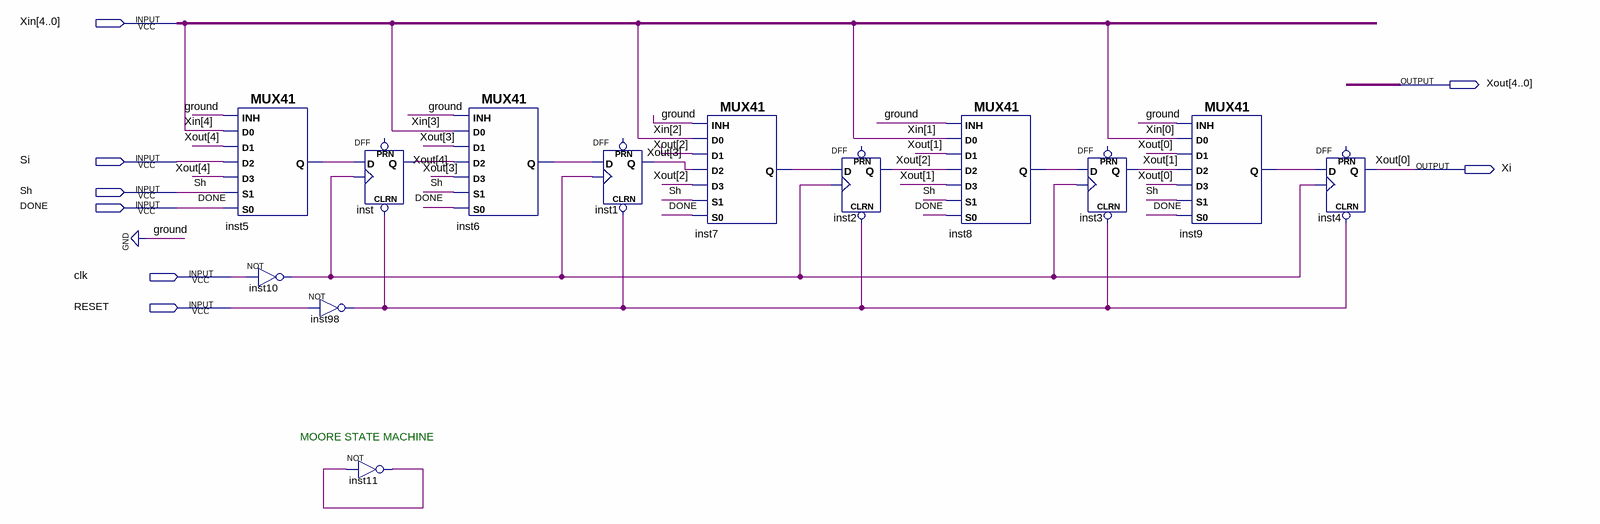
[diagram p0: schematic sheet]
// Quartus schematic xshift.bdf as structural Verilog: 13 symbols, 8 pins
module xshift (
  input  [4:0] Xin,
  input  Si,
  input  Sh,
  input  DONE,
  input  clk,
  input  RESET,
  output [4:0] Xout,
  output Xi
);

  wire inst5_q, inst6_q, inst7_q, inst8_q, inst9_q, inst10_out, inst11_out, inst98_out;

  MUX41 inst5 (.S0(DONE), .D2(Si), .S1(Sh), .D3(Xout[4]), .D0(Xin[4]), .INH(1'b0), .D1(Xout[4]), .Q(inst5_q));
  not inst10 (inst10_out, clk);
  not inst98 (inst98_out, RESET);
  not inst11 (inst11_out, inst11_out);
  DFF inst (.CLRN(inst98_out), .CLK(inst10_out), .D(inst5_q), .Q(Xout[4]));  // open: PRN
  MUX41 inst6 (.S0(DONE), .D2(Xout[4]), .S1(Sh), .D3(Xout[3]), .D0(Xin[3]), .INH(1'b0), .D1(Xout[3]), .Q(inst6_q));
  DFF inst1 (.CLRN(inst98_out), .CLK(inst10_out), .D(inst6_q), .Q(Xout[3]));  // open: PRN
  MUX41 inst7 (.S0(DONE), .D2(Xout[3]), .S1(Sh), .D3(Xout[2]), .D0(Xin[2]), .INH(1'b0), .D1(Xout[2]), .Q(inst7_q));
  DFF inst2 (.CLRN(inst98_out), .CLK(inst10_out), .D(inst7_q), .Q(Xout[2]));  // open: PRN
  MUX41 inst8 (.S0(DONE), .D2(Xout[2]), .S1(Sh), .D3(Xout[1]), .D0(Xin[1]), .INH(1'b0), .D1(Xout[1]), .Q(inst8_q));
  DFF inst3 (.CLRN(inst98_out), .CLK(inst10_out), .D(inst8_q), .Q(Xout[1]));  // open: PRN
  MUX41 inst9 (.S0(DONE), .D2(Xout[1]), .S1(Sh), .D3(Xi), .D0(Xin[0]), .INH(1'b0), .D1(Xi), .Q(inst9_q));
  DFF inst4 (.CLRN(inst98_out), .CLK(inst10_out), .D(inst9_q), .Q(Xi));  // open: PRN

  assign Xout[0] = Xi;

  // Notes on the sheet:
  //   MOORE STATE MACHINE
endmodule
